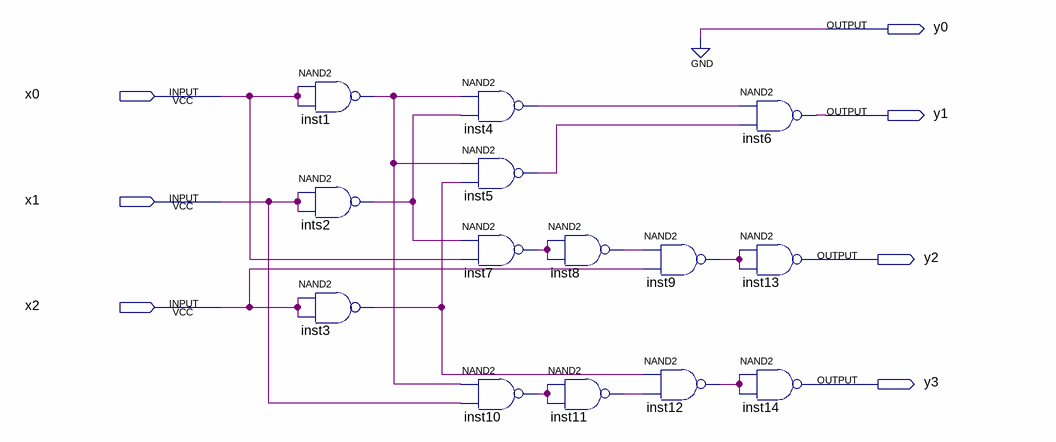
[diagram p0: schematic sheet]
// Quartus schematic Code_converter.bdf as structural Verilog: 14 symbols, 7 pins
module Code_converter (
  input  x0,
  input  x1,
  input  x2,
  output y0,
  output y1,
  output y2,
  output y3
);

  wire inst1_out, inst3_out, inst4_out, inst5_out, inst7_out, inst8_out, inst9_out, inst10_out, inst11_out,
       inst12_out, ints2_out;

  nand inst1 (inst1_out, x0, x0);
  nand ints2 (ints2_out, x1, x1);
  nand inst3 (inst3_out, x2, x2);
  nand inst4 (inst4_out, inst1_out, ints2_out);
  nand inst5 (inst5_out, inst1_out, inst3_out);
  nand inst7 (inst7_out, ints2_out, x0);
  nand inst10 (inst10_out, inst1_out, x1);
  nand inst8 (inst8_out, inst7_out, inst7_out);
  nand inst11 (inst11_out, inst10_out, inst10_out);
  nand inst9 (inst9_out, inst8_out, x2);
  nand inst12 (inst12_out, inst3_out, inst11_out);
  nand inst6 (y1, inst4_out, inst5_out);
  nand inst13 (y2, inst9_out, inst9_out);
  nand inst14 (y3, inst12_out, inst12_out);

  assign y0 = 1'b0;
endmodule
